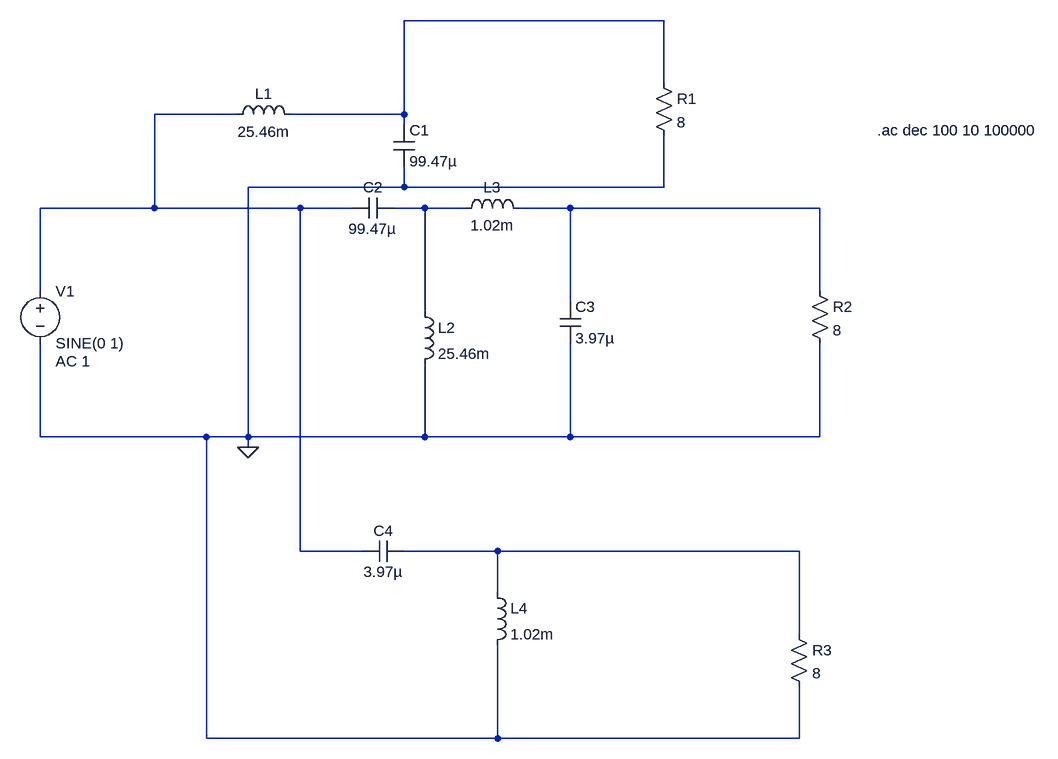
[diagram p0: schematic 3 range speaker Scheamtic.asc]
3 range speaker Scheamtic.asc, the LTspice schematic file:
Version 4.1
SHEET 1 1640 824
WIRE 1040 -288 640 -288
WIRE 1040 -192 1040 -288
WIRE 384 -144 256 -144
WIRE 640 -144 640 -288
WIRE 640 -144 464 -144
WIRE 640 -128 640 -144
WIRE 640 -32 640 -64
WIRE 640 -32 400 -32
WIRE 1040 -32 1040 -112
WIRE 1040 -32 640 -32
WIRE 256 0 256 -144
WIRE 256 0 80 0
WIRE 480 0 256 0
WIRE 560 0 480 0
WIRE 672 0 624 0
WIRE 736 0 672 0
WIRE 896 0 816 0
WIRE 1280 0 896 0
WIRE 80 128 80 0
WIRE 1280 128 1280 0
WIRE 896 144 896 0
WIRE 672 160 672 0
WIRE 80 352 80 208
WIRE 336 352 80 352
WIRE 400 352 400 -32
WIRE 400 352 336 352
WIRE 672 352 672 240
WIRE 672 352 400 352
WIRE 896 352 896 208
WIRE 896 352 672 352
WIRE 1280 352 1280 208
WIRE 1280 352 896 352
WIRE 400 368 400 352
WIRE 480 528 480 0
WIRE 576 528 480 528
WIRE 784 528 640 528
WIRE 1248 528 784 528
WIRE 784 592 784 528
WIRE 1248 656 1248 528
WIRE 336 816 336 352
WIRE 784 816 784 672
WIRE 784 816 336 816
WIRE 1248 816 1248 736
WIRE 1248 816 784 816
FLAG 400 368 0
SYMBOL voltage 80 112 R0
WINDOW 123 24 124 Left 2
WINDOW 39 0 0 Left 0
SYMATTR Value2 AC 1
SYMATTR InstName V1
SYMATTR Value SINE(0 1)
SYMBOL ind 368 -128 R270
WINDOW 0 32 56 VTop 2
WINDOW 3 5 56 VBottom 2
SYMATTR InstName L1
SYMATTR Value 25.46m
SYMBOL cap 624 -128 R0
SYMATTR InstName C1
SYMATTR Value 99.47µ
SYMBOL res 1024 -208 R0
SYMATTR InstName R1
SYMATTR Value 8
SYMBOL cap 624 -16 R90
WINDOW 0 0 32 VBottom 2
WINDOW 3 32 32 VTop 2
SYMATTR InstName C2
SYMATTR Value 99.47µ
SYMBOL ind 656 144 R0
SYMATTR InstName L2
SYMATTR Value 25.46m
SYMBOL ind 720 16 R270
WINDOW 0 32 56 VTop 2
WINDOW 3 5 56 VBottom 2
SYMATTR InstName L3
SYMATTR Value 1.02m
SYMBOL cap 880 144 R0
SYMATTR InstName C3
SYMATTR Value 3.97µ
SYMBOL res 1264 112 R0
SYMATTR InstName R2
SYMATTR Value 8
SYMBOL cap 640 512 R90
WINDOW 0 0 32 VBottom 2
WINDOW 3 32 32 VTop 2
SYMATTR InstName C4
SYMATTR Value 3.97µ
SYMBOL ind 768 576 R0
SYMATTR InstName L4
SYMATTR Value 1.02m
SYMBOL res 1232 640 R0
SYMATTR InstName R3
SYMATTR Value 8
TEXT 1368 -120 Left 2 !.ac dec 100 10 100000

The netlist it stands for:
* 3 range speaker Scheamtic.asc
V1 N002 0 SINE(0 1) AC 1
L1 N002 N001 25.46m
C1 N001 0 99.47µ
R1 N001 0 8
C2 N003 N002 99.47µ
L2 N003 0 25.46m
L3 N003 N004 1.02m
C3 N004 0 3.97µ
R2 N004 0 8
C4 N005 N002 3.97µ
L4 N005 0 1.02m
R3 N005 0 8
.ac dec 100 10 100000
.backanno
.end